# Altium schematic sheet 11_Power.SchDoc: Power (part 1 of 3)
size A3; Organization: Lime Microsystems; Address1: Surrey Tech Centre; Address2: Guildford GU2 7YG; Address3: Surrey; Address4: United Kingdom; Revision: v1.0; SheetNumber: 11; SheetTotal: 11
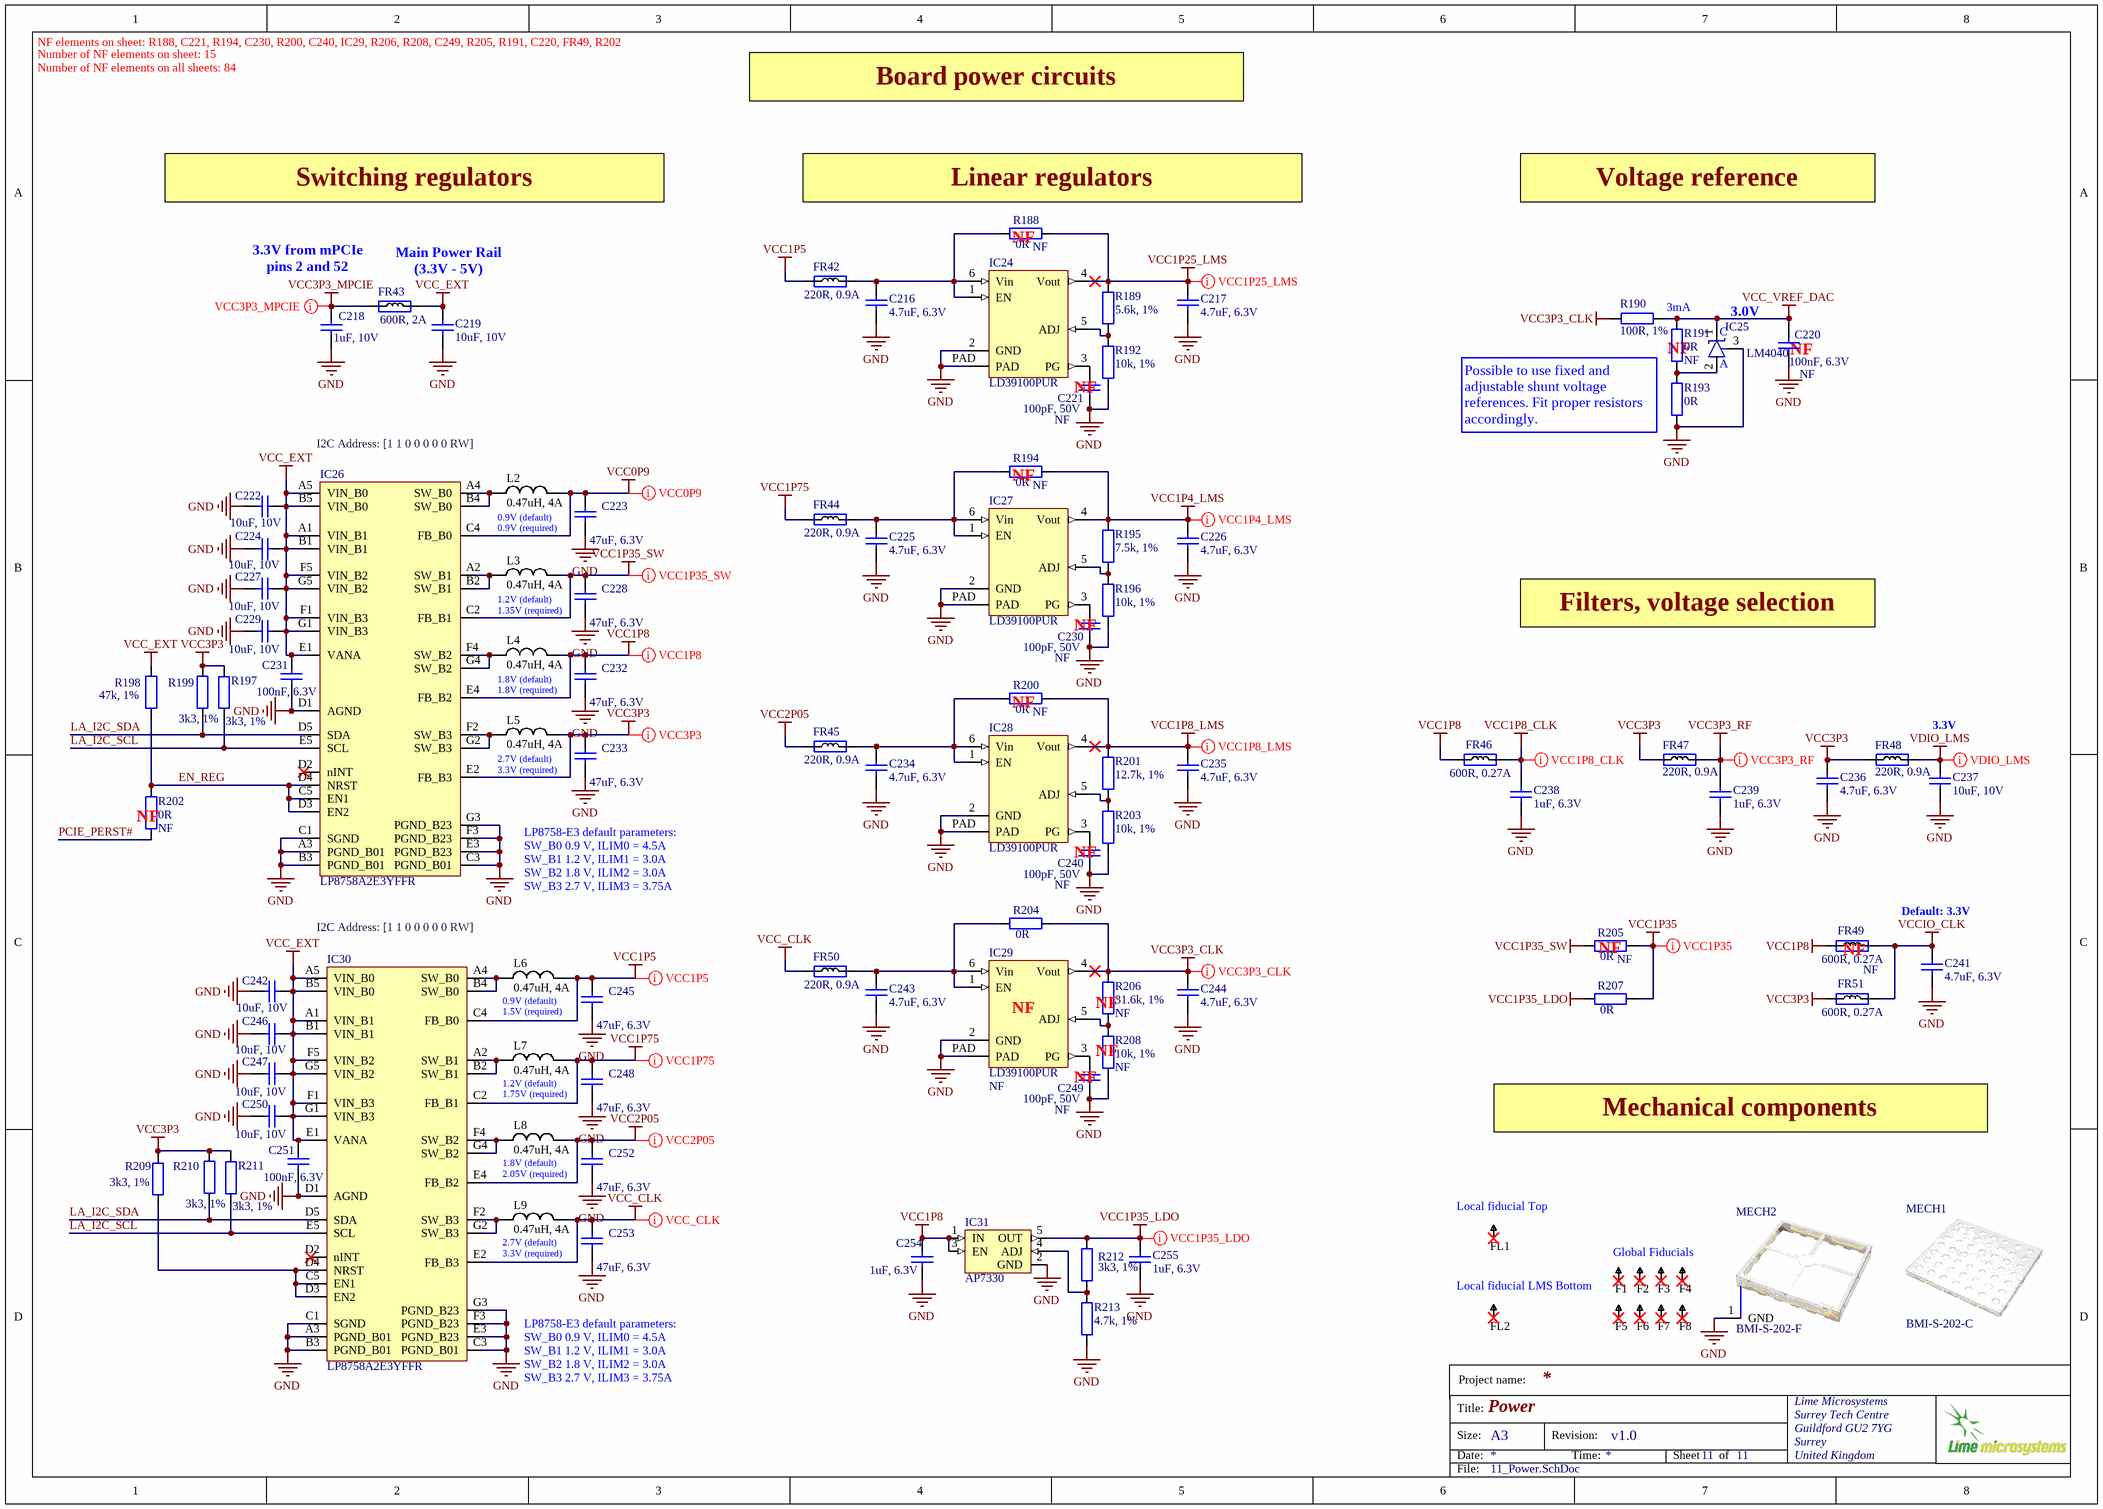
[diagram p0: 11_Power.SchDoc]

## Parts
C216  4.7uF, 6.3V  [CAP0402]
C217  4.7uF, 6.3V  [CAP0402]
C218  1uF, 10V  [CAP0402]
C219  10uF, 10V  [CAP0603]
C220  100nF, 6.3V  Assembly Info: NF  [CAP0201]
C221  100pF, 50V  Assembly Info: NF  [CAP0201]
C222  10uF, 10V  [CAP0603]
C223  47uF, 6.3V  [CAP0603]
C224  10uF, 10V  [CAP0603]
C225  4.7uF, 6.3V  [CAP0402]
C226  4.7uF, 6.3V  [CAP0402]
C227  10uF, 10V  [CAP0603]
C228  47uF, 6.3V  [CAP0603]
C229  10uF, 10V  [CAP0603]
C230  100pF, 50V  Assembly Info: NF  [CAP0201]
C231  100nF, 6.3V  [CAP0201]
C232  47uF, 6.3V  [CAP0603]
C233  47uF, 6.3V  [CAP0603]
C234  4.7uF, 6.3V  [CAP0402]
C235  4.7uF, 6.3V  [CAP0402]
C236  4.7uF, 6.3V  [CAP0402]
C237  10uF, 10V  [CAP0603]
C238  1uF, 6.3V  [CAP0201]
C239  1uF, 6.3V  [CAP0201]
C240  100pF, 50V  Assembly Info: NF  [CAP0201]
C241  4.7uF, 6.3V  [CAP0402]
C242  10uF, 10V  [CAP0603]
C243  4.7uF, 6.3V  [CAP0402]
C244  4.7uF, 6.3V  [CAP0402]
C245  47uF, 6.3V  [CAP0603]
C246  10uF, 10V  [CAP0603]
C247  10uF, 10V  [CAP0603]
C248  47uF, 6.3V  [CAP0603]
C249  100pF, 50V  Assembly Info: NF  [CAP0201]
C250  10uF, 10V  [CAP0603]
C251  100nF, 6.3V  [CAP0201]
C252  47uF, 6.3V  [CAP0603]
C253  47uF, 6.3V  [CAP0603]
C254  1uF, 6.3V  [CAP0201]
C255  1uF, 6.3V  [CAP0201]
F1  Fiducial  [Fiducial]  (value not drawn)
F2  Fiducial  [Fiducial]  (value not drawn)
F3  Fiducial  [Fiducial]  (value not drawn)
F4  Fiducial  [Fiducial]  (value not drawn)
F5  Fiducial  [Fiducial]  (value not drawn)
F6  Fiducial  [Fiducial]  (value not drawn)
F7  Fiducial  [Fiducial]  (value not drawn)
F8  Fiducial  [Fiducial]  (value not drawn)
FL1  Fiducial  [Fiducial_local]  (value not drawn)
FL2  Fiducial  [Fiducial_local]  (value not drawn)
FR42  220R, 0.9A  [RES0402]
FR43  600R, 2A  [RES0805]
FR44  220R, 0.9A  [RES0402]
FR45  220R, 0.9A  [RES0402]
FR46  600R, 0.27A  [RES0201]
FR47  220R, 0.9A  [RES0402]
FR48  220R, 0.9A  [RES0402]
FR49  Assembly Info: NF  [RES0201]  (hidden comment: 600R, 0.27A)
FR50  220R, 0.9A  [RES0402]
FR51  600R, 0.27A  [RES0201]
IC24  LD39100PUR  [LD39100PUR]
IC25  LM4040  [SOT23-3_v3]
IC26  LP8758A2E3YFFR  [LP8758A1E0YFFR_QUAD_DC-DC_35DSBGA]
IC27  LD39100PUR  [LD39100PUR]
IC28  LD39100PUR  [LD39100PUR]
IC29  LD39100PUR  Assembly Info: NF  [LD39100PUR]
IC30  LP8758A2E3YFFR  [LP8758A1E0YFFR_QUAD_DC-DC_35DSBGA]
IC31  AP7330  [AP7330-W5-7_SOT25]
L2  0.47uH, 4A  [IND0806]
L3  0.47uH, 4A  [IND0806]
L4  0.47uH, 4A  [IND0806]
L5  0.47uH, 4A  [IND0806]
L6  0.47uH, 4A  [IND0806]
L7  0.47uH, 4A  [IND0806]
L8  0.47uH, 4A  [IND0806]
L9  0.47uH, 4A  [IND0806]
MECH1  BMI-S-202-C  [BMI-S-202-C_RF_SHIELD_COVER]
MECH2  BMI-S-202-F  [BMI-S-202-F_RF_SHIELD_FRAME_v3]
R188  0R  Assembly Info: NF  [RES0201]
R189  5.6k, 1%  [RES0201]
R190  100R, 1%  [RES0201]
R191  0R  Assembly Info: NF  [RES0201]
R192  10k, 1%  [RES0201]
R193  0R  [RES0201]
R194  0R  Assembly Info: NF  [RES0201]
R195  7.5k, 1%  [RES0201]
R196  10k, 1%  [RES0201]
R197  3k3, 1%  [RES0201]
R198  47k, 1%  [RES0201]
R199  3k3, 1%  [RES0201]
R200  0R  Assembly Info: NF  [RES0201]
R201  12.7k, 1%  [RES0201]
R202  0R  Assembly Info: NF  [RES0201]
R203  10k, 1%  [RES0201]
R204  0R  [RES0201]
R205  0R  Assembly Info: NF  [RES0201]
R206  31.6k, 1%  Assembly Info: NF  [RES0201]
R207  0R  [RES0201]
R208  10k, 1%  Assembly Info: NF  [RES0201]
R209  3k3, 1%  [RES0201]
R210  3k3, 1%  [RES0201]
R211  3k3, 1%  [RES0201]
R212  3k3, 1%  [RES0201]
R213  4.7k, 1%  [RES0201]

## Nets
GND: C216.1 C217.1 C218.1 C219.1 C220.2 C221.1 C222.1 C223.1 C224.1 C225.1 C226.1 C227.1 C228.1 C229.1 C230.1 C231.2 C232.1 C233.1 C234.1 C235.1 C236.1 C237.1 C238.2 C239.2 C240.1 C241.1 C242.1 C243.1 C244.1 C245.1 C246.1 C247.1 C248.1 C249.1 C250.1 C251.2 C252.1 C253.1 C254.2 C255.2 IC24.2(GND) IC24.PAD IC25.3(NC/A) IC26.A3(PGND_B01) IC26.B3(PGND_B01) IC26.C1(SGND) IC26.C3(PGND_B01) IC26.D1(AGND) IC26.E3(PGND_B23) IC26.F3(PGND_B23) IC26.G3(PGND_B23) IC27.2(GND) IC27.PAD IC28.2(GND) IC28.PAD IC29.2(GND) IC29.PAD IC30.A3(PGND_B01) IC30.B3(PGND_B01) IC30.C1(SGND) IC30.C3(PGND_B01) IC30.D1(AGND) IC30.E3(PGND_B23) IC30.F3(PGND_B23) IC30.G3(PGND_B23) IC31.2(GND) MECH2.1(GND) R192.2 R193.2 R196.2 R203.2 R208.2 R213.2
VCC0P9: C223.2 IC26.C4(FB_B0) L2.2
VCC1P4_LMS: C226.2 IC27.4(Vout) R194.2 R195.1
VCC1P5: C245.2 FR42.1 IC30.C4(FB_B0) L6.2
VCC1P8: C232.2 C254.1 FR46.1 FR49.1 IC26.E4(FB_B2) IC31.1(IN) IC31.3(EN) L4.2
VCC1P8_CLK: C238.1 FR46.2
VCC1P8_LMS: C235.2 IC28.4(Vout) R200.2 R201.1
VCC1P25_LMS: C217.2 IC24.4(Vout) R188.2 R189.1
VCC1P35: R205.2 R207.2
VCC1P35_LDO: C255.1 IC31.5(OUT) R207.1 R212.1
VCC1P35_SW: C228.2 IC26.C2(FB_B1) L3.2 R205.1
VCC1P75: C248.2 FR44.1 IC30.C2(FB_B1) L7.2
VCC2P05: C252.2 FR45.1 IC30.E4(FB_B2) L8.2
VCC3P3: C233.2 C236.2 FR47.1 FR48.1 FR51.1 IC26.E2(FB_B3) L5.2 R197.1 R199.1 R209.1 R210.1 R211.1
VCC3P3_CLK: C244.2 IC29.4(Vout) R190.2 R204.2 R206.1
VCC3P3_MPCIE: C218.2 FR43.1
VCC3P3_RF: C239.1 FR47.2
VCC_CLK: C253.2 FR50.1 IC30.E2(FB_B3) L9.2
VCC_EXT: C219.2 C222.2 C224.2 C227.2 C229.2 C231.1 C242.2 C246.2 C247.2 C250.2 C251.1 FR43.2 IC26.A1(VIN_B1) IC26.A5(VIN_B0) IC26.B1(VIN_B1) IC26.B5(VIN_B0) IC26.E1(VANA) IC26.F1(VIN_B3) IC26.F5(VIN_B2) IC26.G1(VIN_B3) IC26.G5(VIN_B2) IC30.A1(VIN_B1) IC30.A5(VIN_B0) IC30.B1(VIN_B1) IC30.B5(VIN_B0) IC30.E1(VANA) IC30.F1(VIN_B3) IC30.F5(VIN_B2) IC30.G1(VIN_B3) IC30.G5(VIN_B2) R198.1
VCC_VREF_DAC: C220.1 IC25.1(K) R190.1 R191.1
VCCIO_CLK: C241.2 FR49.2 FR51.2
VDIO_LMS: C237.2 FR48.2
EN_REG: IC26.C5(EN1) IC26.D3(EN2) IC26.D4(NRST) R198.2 R202.2
LA_I2C_SCL: IC26.E5(SCL) IC30.E5(SCL) R197.2 R211.2
LA_I2C_SDA: IC26.D5(SDA) IC30.D5(SDA) R199.2 R210.2
PCIE_PERST#: R202.1
NetC216_2: C216.2 FR42.2 IC24.1(EN) IC24.6(Vin) R188.1
NetC221_2: C221.2 IC24.3(PG)
NetC225_2: C225.2 FR44.2 IC27.1(EN) IC27.6(Vin) R194.1
NetC230_2: C230.2 IC27.3(PG)
NetC234_2: C234.2 FR45.2 IC28.1(EN) IC28.6(Vin) R200.1
NetC240_2: C240.2 IC28.3(PG)
NetC243_2: C243.2 FR50.2 IC29.1(EN) IC29.6(Vin) R204.1
NetC249_2: C249.2 IC29.3(PG)
NetIC24_5: IC24.5(ADJ) R189.2 R192.1
NetIC25_2: IC25.2(A) R191.2 R193.1
NetIC26_A2: IC26.A2(SW_B1) IC26.B2(SW_B1) L3.1
NetIC26_A4: IC26.A4(SW_B0) IC26.B4(SW_B0) L2.1
NetIC26_F2: IC26.F2(SW_B3) IC26.G2(SW_B3) L5.1
NetIC26_F4: IC26.F4(SW_B2) IC26.G4(SW_B2) L4.1
NetIC27_5: IC27.5(ADJ) R195.2 R196.1
NetIC28_5: IC28.5(ADJ) R201.2 R203.1
NetIC29_5: IC29.5(ADJ) R206.2 R208.1
NetIC30_A2: IC30.A2(SW_B1) IC30.B2(SW_B1) L7.1
NetIC30_A4: IC30.A4(SW_B0) IC30.B4(SW_B0) L6.1
NetIC30_C5: IC30.C5(EN1) IC30.D3(EN2) IC30.D4(NRST) R209.2
NetIC30_F2: IC30.F2(SW_B3) IC30.G2(SW_B3) L9.1
NetIC30_F4: IC30.F4(SW_B2) IC30.G4(SW_B2) L8.1
NetIC31_4: IC31.4(ADJ) R212.2 R213.1

Not connected (* = marked no-connect by the designer): F1 1*; F2 1*; F3 1*; F4 1*; F5 1*; F6 1*; F7 1*; F8 1*; FL1 1*; FL2 1*; IC26 D2(nINT)*; IC30 D2(nINT)*

## Layout directives
net class VCC1P25_LMS: VCC1P25_LMS
net class VCC1P4_LMS: VCC1P4_LMS
net class VCC1P8_LMS: VCC1P8_LMS
net class VCC3P3_CLK: VCC3P3_CLK
net class VCC1P5: VCC1P5
net class VCC0P9: VCC0P9
net class VCC3P3_MPCIE: VCC3P3_MPCIE
net class VCC1P35_SW: VCC1P35_SW
net class VCC1P8: VCC1P8
net class VCC3P3: VCC3P3
net class VCC1P75: VCC1P75
net class VCC2P5: VCC2P05
net class VCC_CLK: VCC_CLK
net class VCC1P35_LDO: VCC1P35_LDO
net class VDIO_LMS: VDIO_LMS
net class VCC1P35: VCC1P35
net class VCC3P3_RF: VCC3P3_RF
net class VCC1P8_CLK: VCC1P8_CLK

## Notes on the sheet
- NF elements on sheet: R188, C221, R194, C230, R200, C240, IC29, R206, R208, C249, R205, R191, C220, FR49, R202
- Number of NF elements on sheet: 15
- Number of NF elements on all sheets: 84
- Board power circuits
- Switching regulators
- (near R188) Linear regulators
- (near R188) NF
- Voltage reference
- 3.3V from mPCIe pins 2 and 52
- (near FR43) Main Power Rail
  (3.3V - 5V)
- 3mA
- 3.0V
- (near R191) NF
- (near IC25) A
- (near IC25) C
- (near C220) NF
- I2C Address: [1 1 0 0 0 0 0 RW]
- NF
- Possible to use fixed and adjustable shunt voltage references. Fit proper resistors accordingly.
- (near R194) NF
- 0.9V (default)
  0.9V (required)
- 1.2V (default)
  1.35V (required)
- Filters, voltage selection
- 1.8V (default)
  1.8V (required)
- (near R200) NF
- 2.7V (default)
  3.3V (required)
- 3.3V
- (near R202) NF
- LP8758-E3 default parameters:
  SW_B0 0.9 V, ILIM0 = 4.5A
  SW_B1 1.2 V, ILIM1 = 3.0A
  SW_B2 1.8 V, ILIM2 = 3.0A
  SW_B3 2.7 V, ILIM3 = 3.75A
- Default: 3.3V
- (near R205) NF
- (near FR49) NF
- 0.9V (default)
  1.5V (required)
- (near IC29) NF
- (near R208) NF
- (near R206) NF
- 1.2V (default)
  1.75V (required)
- Mechanical components
- 1.8V (default)
  2.05V (required)
- (near FL1) Local fiducial Top
- Global Fiducials
- Local fiducial LMS Bottom
- Project name:
- Title:
- Size:
- Date:
- A3
- Revision:
- Time:
- Sheet
- of
- File: